# Altium project RasPi-BplusHAT.PrjPcb
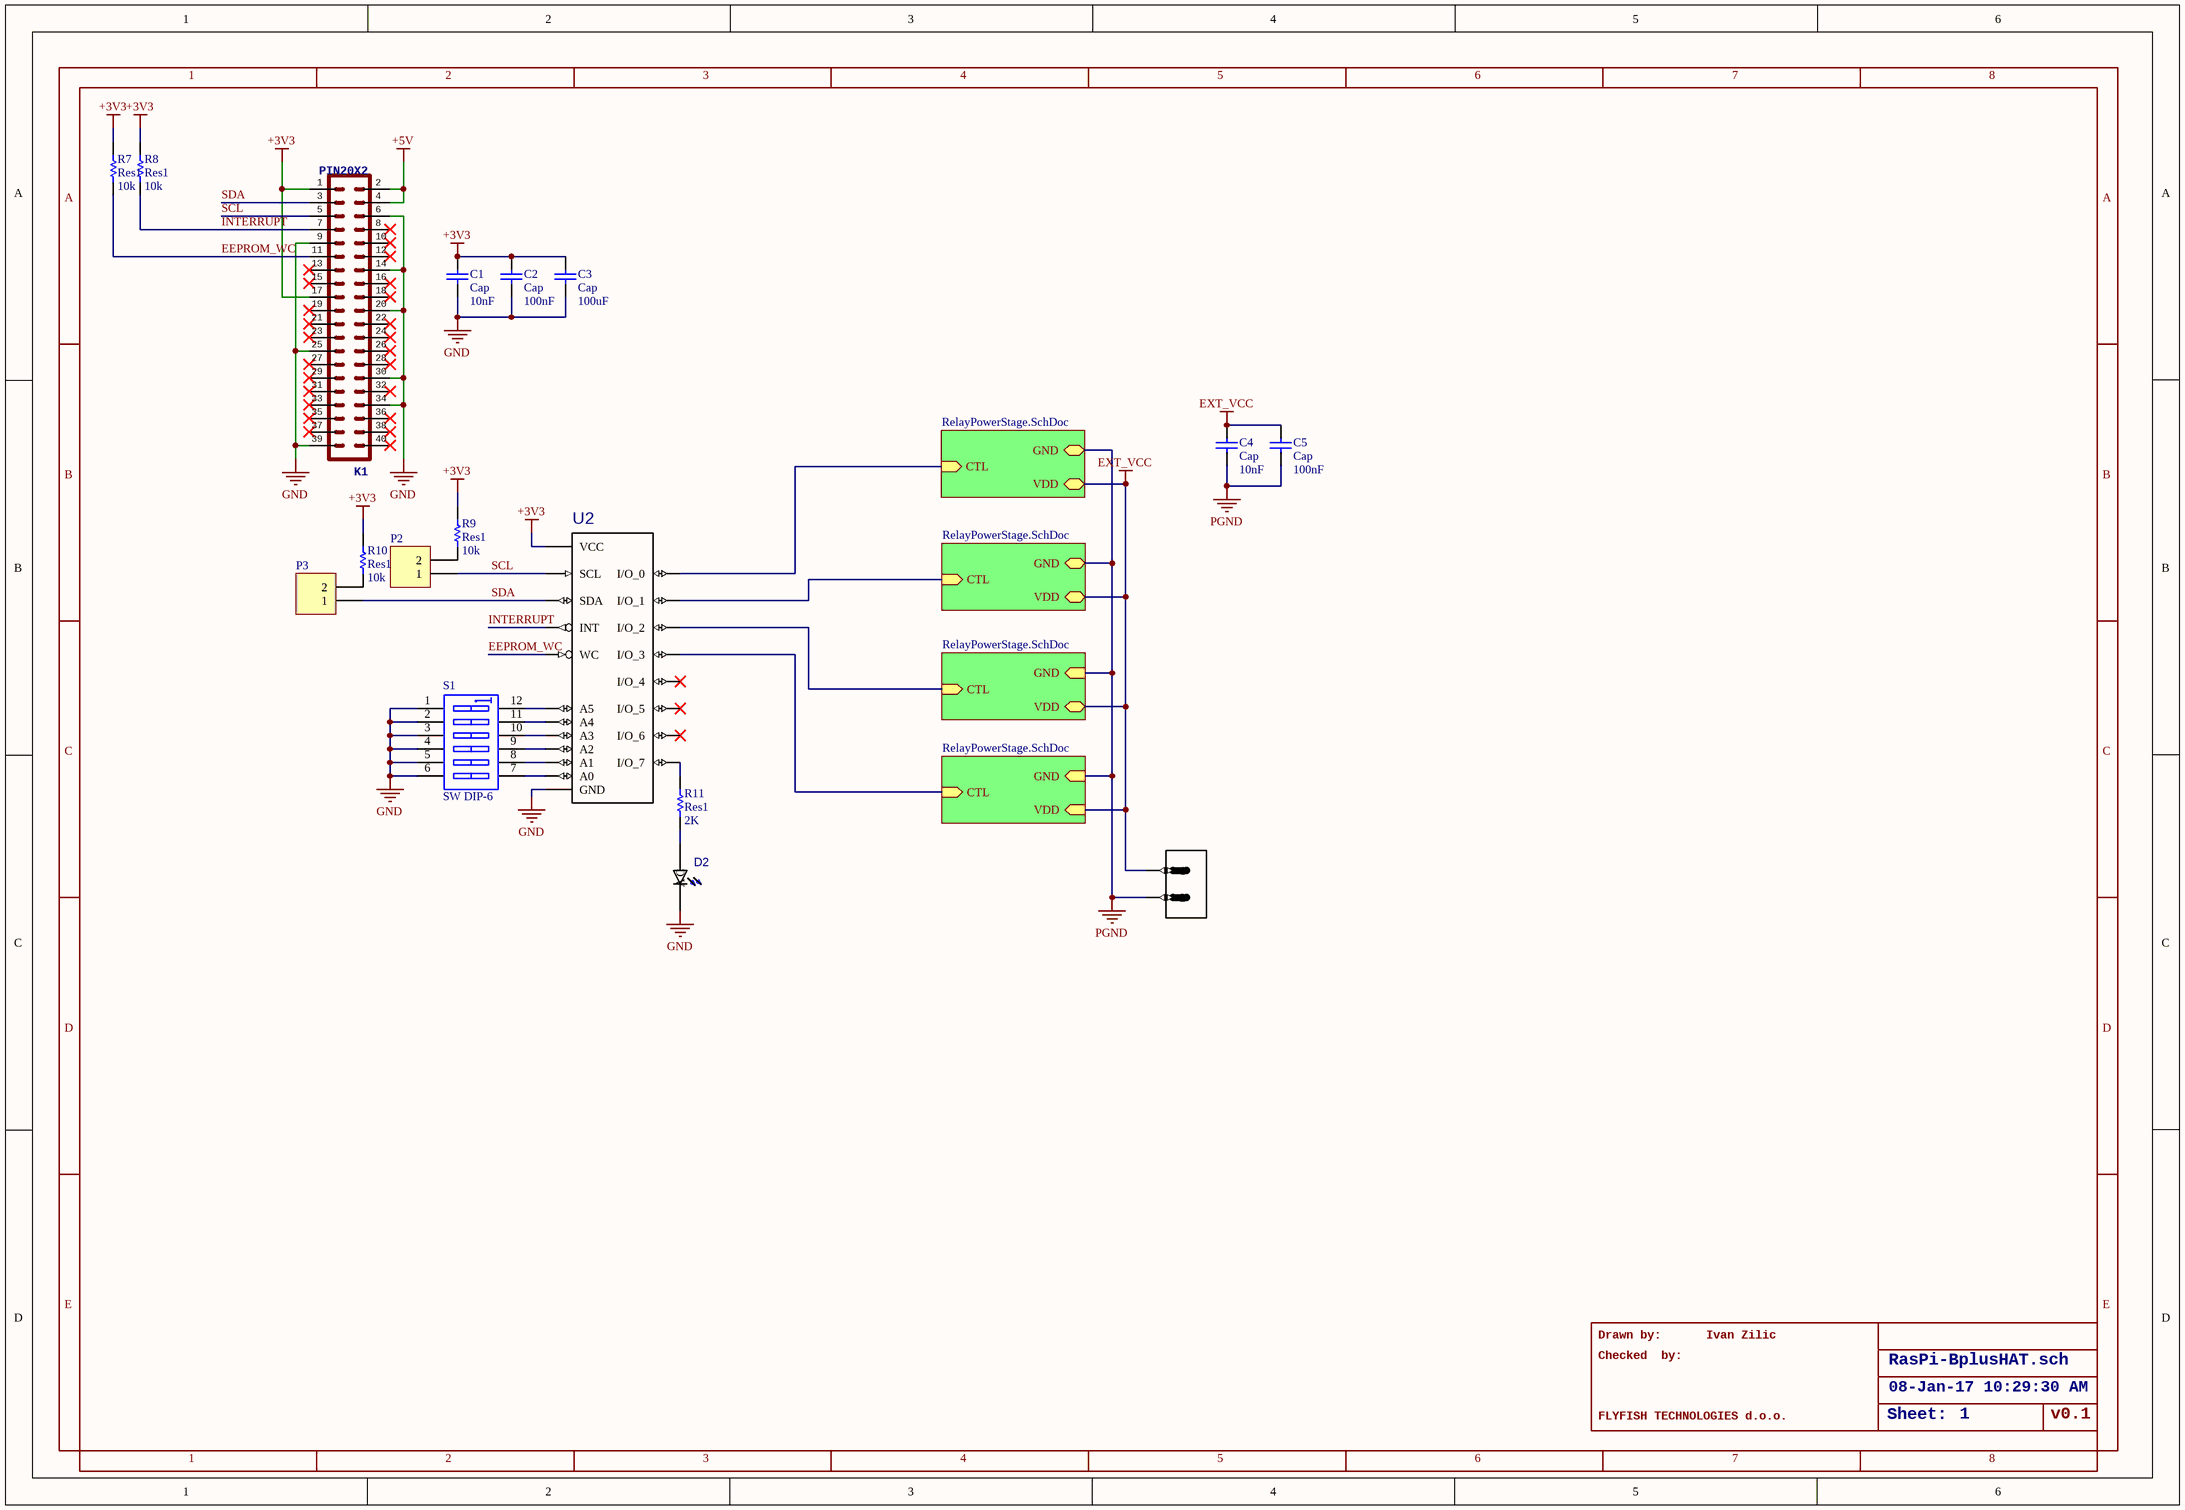
[diagram p0: RasPi-BplusHAT-RELAY.SchDoc]
3 sheets, 79 parts. Net scope: hierarchical (ports join the sheet entries above them; power ports are global).
Board files: RasPi-BplusHAT-MOSFET.PcbDoc, RasPi-BplusHAT-RELAY.PcbDoc
Sheets:
  RasPi-BplusHAT-RELAY.SchDoc
    RM = RelayPowerStage.SchDoc
    RM = RelayPowerStage.SchDoc
    RM = RelayPowerStage.SchDoc
    RM = RelayPowerStage.SchDoc
  MOSFETPowerStage.SchDoc

## Sheet RasPi-BplusHAT-RELAY.SchDoc
size 409 x 282 mm; >DRAWING_NAME: RasPi-BplusHAT.sch; >LAST_DATE_TIME: 08-Jan-17 10:29:30 AM; >SHEET: 1; Sheet:: Sheet:

### Parts
C1  Cap  value 10nF  [6-0805_N]
C2  Cap  value 100nF  [6-0805_N]
C3  Cap  value 100uF  [6-0805_N]
C4  Cap  value 10nF  [6-0805_N]
C5  Cap  value 100nF  [6-0805_N]
D2  0805_LED  [LEDSC200X125X70-2N_598-8160-107F(Primary)]  (value not drawn)
J2  1760510000  [1760490000]  (value not drawn)
K1  >NAME: K1  [HDR2X20]  (hidden comment: PIN20X2)
P2  Header 2  [HDR1X2]  (value not drawn)
P3  Header 2  [HDR1X2]  (value not drawn)
R7  Res1  value 10k  [6-0805_N]
R8  Res1  value 10k  [6-0805_N]
R9  Res1  value 10k  [6-0805_N]
R10  Res1  value 10k  [6-0805_N]
R11  Res1  value 2K  [6-0805_N]
S1  SW DIP-6  [DIP-12/SW]
U2  PCA9501  [TSSOP20]  (value not drawn)

### Sub-sheets
RM = RelayPowerStage.SchDoc: VDD (bidir), GND (bidir), CTL (in)
RM = RelayPowerStage.SchDoc: VDD (bidir), GND (bidir), CTL (in)
RM = RelayPowerStage.SchDoc: VDD (bidir), GND (in), CTL (in)
RM = RelayPowerStage.SchDoc: VDD (in), GND (in), CTL (in)

### Nets
+3V3: C1.2 C2.2 C3.2 K1.1 K1.17 R7.1 R8.1 R9.1 R10.1 U2.20(VCC)
+5V: K1.2 K1.4
EXT_VCC: C4.2 C5.2 J2.1 ; sheet RM/VDD, sheet RM/VDD, sheet RM/VDD, sheet RM/VDD
GND: C1.1 C2.1 C3.1 D2.C K1.6 K1.9 K1.14 K1.20 K1.25 K1.30 K1.34 K1.39 S1.1(A1) S1.2(A2) S1.3(A3) S1.4(A4) S1.5(A5) S1.6(A6) U2.10(GND)
PGND: C4.1 C5.1 J2.2 ; sheet RM/GND, sheet RM/GND, sheet RM/GND, sheet RM/GND
EEPROM_WC: K1.11 R7.2 U2.17(WC)
INTERRUPT: K1.7 R8.2 U2.8(INT)
SCL: K1.5 P2.1 U2.18(SCL)
SDA: K1.3 P3.1 U2.19(SDA)
NetD2_A: D2.A R11.2
NetP2_2: P2.2 R9.2
NetP3_2: P3.2 R10.2
NetR3_RM1_1: U2.7(I/O_3) ; sheet RM/CTL
NetR3_RM2_1: U2.6(I/O_2) ; sheet RM/CTL
NetR3_RM3_1: U2.5(I/O_1) ; sheet RM/CTL
NetR3_RM4_1: U2.4(I/O_0) ; sheet RM/CTL
NetR11_1: R11.1 U2.16(I/O_7)
NetS1_7: S1.7(B6) U2.1(A0)
NetS1_8: S1.8(B5) U2.2(A1)
NetS1_9: S1.9(B4) U2.3(A2)
NetS1_10: S1.10(B3) U2.12(A3)
NetS1_11: S1.11(B2) U2.11(A4)
NetS1_12: S1.12(B1) U2.9(A5)

Not connected (* = marked no-connect by the designer): K1 8* 10* 12* 13* 15* 16* 18* 19* 21* 22* 23* 24* 26* 27* 28* 29* 31* 32* 33* 35* 36* 37* 38* 40*; U2 13(I/O_4)* 14(I/O_5)* 15(I/O_6)*

### Notes on the sheet
- Drawn by:
- Checked  by:
- Ivan Zilic
- FLYFISH TECHNOLOGIES d.o.o.
- v0.1
- 1
- 2
- 3
- 4
- 5
- 6
- 7
- 8
- A
- B
- C
- D
- E

### Library data of the parts
C1-C5 = Cap: Capacitor; Published: 8-Jun-2000; LatestRevisionDate: 17-Jul-2002; LatestRevisionNote: Re-released for DXP Platform.; PackageReference: RAD-0.3; Publisher: Altium Limited; PackageDescription: Radial Cap, Thru-Hole; 2 Leads; 0.3 in Pin Spacing
D2 = 598-8160-107F: LED, SMD; 0805; Yellow-Green; Water Clear Lens; 40mcd; 570/575nm; MF: Dialight; Package: 0805 Dialight; MP: 598-8160-107F; Price: 0.09 USD; Availability: Good; Value: *
J2 = 1760510000: Conn Terminal Block 2 POS 5.08mm Solder ST Thru-Hole 16A; MF: Weidmuller; Package: None; MP: 1760510000; Price: 0.43 USD; Availability: Good; Value: *
P2 P3 = Header 2: Header, 2-Pin; LatestRevisionDate: 17-Jul-2002; LatestRevisionNote: Re-released for DXP Platform.; Publisher: Altium Limited
R7-R11 = Res1: Resistor; Published: 8-Jun-2000; LatestRevisionDate: 17-Jul-2002; LatestRevisionNote: Re-released for DXP Platform.; PackageReference: AXIAL-0.3; Publisher: Altium Limited; PackageDescription: Axial Device, Thru-Hole; 2 Leads; 0.3 in Pin Spacing
S1 = SW DIP-6: DIP Switch, 6 Position, SPST; Published: 24-Mar-1999; LatestRevisionDate: 17-Jul-2002; LatestRevisionNote: Re-released for DXP Platform.; PackageReference: DIP-12/SW; Publisher: Altium Limited; PackageDescription: DIP Switch; 12 Leads
U2 = PCA9501: MF: NXP Semiconductors; MP: PCA9501; Package: None; Availability: Unavailable; Price: None; Value: *
K1 = PIN20X2: >VALUE: PIN20X2

## Sheet RelayPowerStage.SchDoc
size A4
Used 4 times, as channels RM, RM, RM, RM. Parts and nets are listed once, with the designators drawn on the sheet.
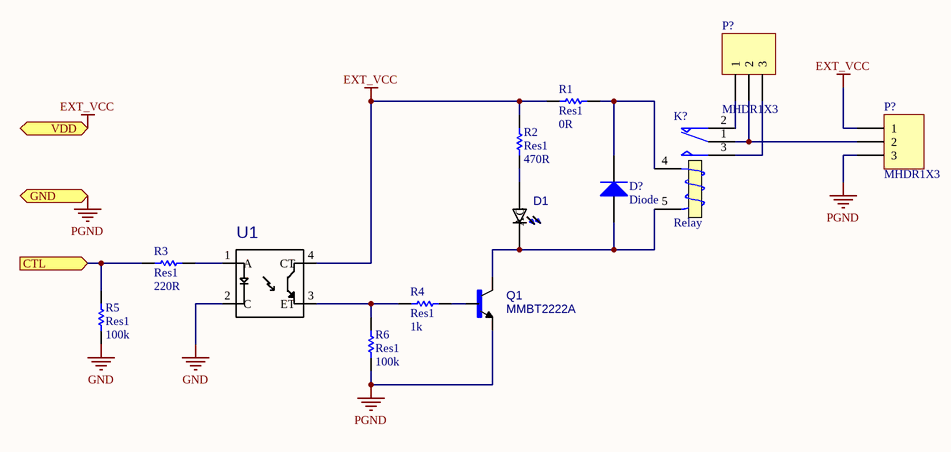
[diagram p1: RelayPowerStage.SchDoc]

### Parts
(Parts that share a designator on the sheet are numbered #1, #2 ... from top to bottom, then left to right.)
D1  0805_LED  [LEDSC200X125X70-2N_598-8160-107F(Primary)]  (value not drawn)
D?  Diode  [S1JL]
K?  Relay  [OUAZ-SH-112L (Mini Relay)]
P?#1  MHDR1X3  [MHDR1X3]
P?#2  MHDR1X3  [MHDR1X3]
Q1  MMBT2222A  [SOT23]
R1  Res1  value 0R  [6-0805_N]
R2  Res1  value 470R  [6-0805_N]
R3  Res1  value 220R  [6-0805_N]
R4  Res1  value 1k  [6-0805_N]
R5  Res1  value 100k  [6-0805_N]
R6  Res1  value 100k  [6-0805_N]
U1  PC817X2NIP0F  [SOT254P975X400-4N]  (value not drawn)

### Ports
CTL (in), GND (in), VDD (in)

### Nets
EXT_VCC: P?#2.1 R1.1 R2.1 U1.4(CT) ; port VDD
GND: R5.2 U1.2(C)
PGND: P?#2.3 Q1.2(E) R6.2 ; port GND
CTL: R3.1 R5.1 ; port CTL
NetD1_A: D1.A R2.2
NetD1_C: D1.C D?.1(A) K?.5(T2) Q1.3(C)
NetD?_2: D?.2(K) K?.4(T1) R1.2
NetK?_1: K?.1(COM) P?#1.2 P?#2.2
NetK?_2: K?.2(NC) P?#1.1
NetK?_3: K?.3(NO) P?#1.3
NetQ1_1: Q1.1(B) R4.2
NetR3_2: R3.2 U1.1(A)
NetR4_1: R4.1 R6.1 U1.3(ET)

### Channels
RM: designators D1=D1_RM#1 D?=D?_RM#1 K?=K?_RM#1 P?=P?_RM#1 P?=P?_RM#2 Q1=Q1_RM#1 R1=R1_RM4 R2=R2_RM4 R3=R3_RM4 R4=R4_RM4 R5=R5_RM4 R6=R6_RM4 U1=U1_RM4; ports CTL=NetR3_RM4_1 GND=PGND VDD=EXT_VCC
RM: designators D1=D1_RM#2 D?=D?_RM#2 K?=K?_RM#2 P?=P?_RM#3 P?=P?_RM#4 Q1=Q1_RM#2 R1=R1_RM3 R2=R2_RM3 R3=R3_RM3 R4=R4_RM3 R5=R5_RM3 R6=R6_RM3 U1=U1_RM3; ports CTL=NetR3_RM3_1 GND=PGND VDD=EXT_VCC
RM: designators D1=D1_RM#3 D?=D?_RM#3 K?=K?_RM#3 P?=P?_RM#5 P?=P?_RM#6 Q1=Q1_RM#3 R1=R1_RM2 R2=R2_RM2 R3=R3_RM2 R4=R4_RM2 R5=R5_RM2 R6=R6_RM2 U1=U1_RM2; ports CTL=NetR3_RM2_1 GND=PGND VDD=EXT_VCC
RM: designators D1=D1_RM#4 D?=D?_RM#4 K?=K?_RM#4 P?=P?_RM#7 P?=P?_RM#8 Q1=Q1_RM#4 R1=R1_RM1 R2=R2_RM1 R3=R3_RM1 R4=R4_RM1 R5=R5_RM1 R6=R6_RM1 U1=U1_RM1; ports CTL=NetR3_RM1_1 GND=PGND VDD=EXT_VCC

### Library data of the parts
D1 = 598-8160-107F: as D2 on sheet RasPi-BplusHAT-RELAY; Package: 0805 Dialight; MP: 598-8160-107F; Price: 0.09 USD; Availability: Good; Value: *
D? = Diode: Default Diode; Published: 8-Jun-2000; LatestRevisionDate: 17-Jul-2002; LatestRevisionNote: Re-released for DXP Platform.; PackageVersion: Sep-1996; PackageReference: SMC; Publisher: Altium Limited; PackageDescription: DO-214-AB/SMC; 2 C-Bend Leads; Body 7.9 x 5.9 mm, inc. leads (LxW); Code_JEDEC: DO-214-AB
K? = Relay: SPDT Relay; Published: 8-Jun-2000; LatestRevisionDate: 17-Jul-2002; LatestRevisionNote: Re-released for DXP Platform.; PackageReference: MODULE5B; Publisher: Altium Limited; Datasheet: http://au.element14.com/te-connectivity/ouaz-sh-112l/relay-signal-spdt-120vac-24vdc/dp/1197687
P?#1 P?#2 = MHDR1X3: Header, 3-Pin; LatestRevisionDate: 17-Jul-2002; LatestRevisionNote: Re-released for DXP Platform.; Publisher: Altium Limited
Q1 = MMBT2222A: MMBT2222 Series 40 V CE Breakdown 1 A NPN General Purpose Amplifier - SOT-23; MF: Fairchild Semiconductor; Package: SOT-23 Fairchild Semiconductor; MP: MMBT2222A; Price: 0.06 USD; Availability: Good; Value: *
R1-R6 = Res1: Resistor; Published: 8-Jun-2000; LatestRevisionDate: 17-Jul-2002; LatestRevisionNote: Re-released for DXP Platform.; PackageReference: AXIAL-0.3; Publisher: Altium Limited; PackageDescription: Axial Device, Thru-Hole; 2 Leads; 0.3 in Pin Spacing
U1 = PC817X2NIP0F: PC817 Series 1 Channel 80 V 5000 Vrms General Purpose Photocoupler - DIP-4; MF: Sharp Microelectronics; Availability: Good; Price: 0.30 USD; Package: PDIP-4 Sharp Microelectronics; MP: PC817X2NIP0F; Value: *

## Sheet MOSFETPowerStage.SchDoc
size A4
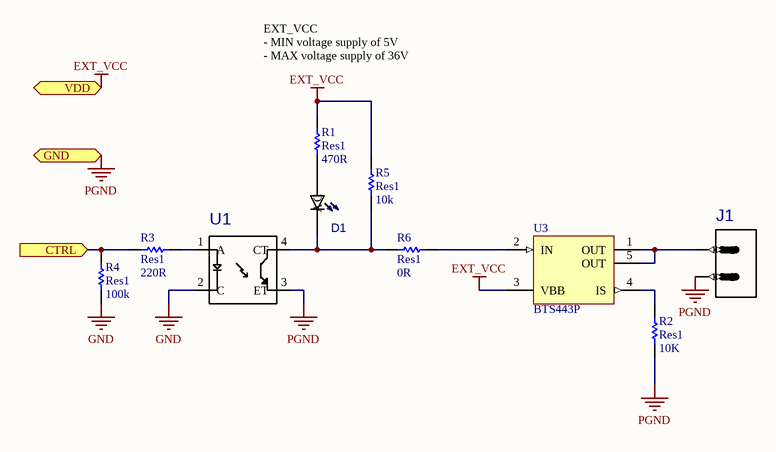
[diagram p2: MOSFETPowerStage.SchDoc]

### Parts
D1  0805_LED  [LEDSC200X125X70-2N_598-8160-107F(Primary)]  (value not drawn)
J1  1760510000  [1760490000]  (value not drawn)
R1  Res1  value 470R  [6-0805_N]
R2  Res1  value 10K  [6-0805_N]
R3  Res1  value 220R  [6-0805_N]
R4  Res1  value 100k  [6-0805_N]
R5  Res1  value 10k  [6-0805_N]
R6  Res1  value 0R  [6-0805_N]
U1  PC817X2NIP0F  [SOT254P975X400-4N]  (value not drawn)
U3  BTS443P  [INF-PG-TO252-5-11_N]

### Ports
CTRL (in), GND, VDD

### Nets
EXT_VCC: R1.1 R5.1 U3.3(VBB) ; port VDD
GND: R4.2 U1.2(C)
PGND: J1.2 R2.2 U1.3(ET) ; port GND
NetD1_A: D1.A R1.2
NetD1_C: D1.C R5.2 R6.1 U1.4(CT)
NetJ1_1: J1.1 U3.1(OUT) U3.5(OUT)
NetR2_1: R2.1 U3.4(IS)
NetR3_1: R3.1 R4.1 ; port CTRL
NetR3_2: R3.2 U1.1(A)
NetR6_2: R6.2 U3.2(IN)

### Notes on the sheet
- EXT_VCC
  - MIN voltage supply of 5V
  - MAX voltage supply of 36V

### Library data of the parts
D1 = 598-8160-107F: as D2 on sheet RasPi-BplusHAT-RELAY; Package: 0805 Dialight; MP: 598-8160-107F; Price: 0.09 USD; Availability: Good; Value: *
J1 = 1760510000: as J2 on sheet RasPi-BplusHAT-RELAY; Package: None; MP: 1760510000; Price: 0.43 USD; Availability: Good; Value: *
R1-R6 = Res1: Resistor; Published: 8-Jun-2000; LatestRevisionDate: 17-Jul-2002; LatestRevisionNote: Re-released for DXP Platform.; PackageReference: AXIAL-0.3; Publisher: Altium Limited; PackageDescription: Axial Device, Thru-Hole; 2 Leads; 0.3 in Pin Spacing
U1 = PC817X2NIP0F: as U1 on sheet RelayPowerStage; Availability: Good; Price: 0.30 USD; Package: PDIP-4 Sharp Microelectronics; MP: PC817X2NIP0F; Value: *
U3 = BTS443P: Smart High-Side Power Switch, 1 Channel, 7.6 A Load Current, -40 to 150 degC, PG-TO252-5-11, Reel, Green; Manufacturer: Infineon; Channels: 1; Green: TRUE; Group: Automotive Qualified; Load Current (typ): 7.6 A; Ptot (max): 42 W; Recommended Operating Voltage Max.: 36 V; Recommended Operating Voltage Min.: 5 V; RON @ 25degreesC: 16 mOhm; RON(max) @ 150degreesC: 31 mOhm; toff (max): 410 us; DatasheetVersion: Rev. 1.0; PackageVersion: Nov-10; PackageReference: PG-TO252-5-11; PackageDescription: 5-Pin Plastic (Green) Transistor Single Outline Package, 6.5 x 6.12 mm Body, 1.14 mm Pitch; Supplier 1: Mouser; Supplier Part Number 1: 726-BTS443P; Supplier 2: Newark; Supplier Part Number 2: 58M4071; Supplier 3: Farnell; Supplier Part Number 3: 1440808; Supplier 4: Farnell; Supplier Part Number 4: 1440808RL; Supplier 5: Digi-Key; Supplier Part Number 5: BTS443PINTR-ND; Supplier 6: Digi-Key; Supplier Part Number 6: BTS443PINCT-ND; Supplier 7: Digi-Key; Supplier Part Number 7: BTS443PINDKR-ND; Halogen-free: TRUE; Packing: Reel; ton (max): 410 us; Mounting Technology: Surface Mount; PartNumber: BTS443P; ComponentLink1Description: Manufacturer URL; ComponentLink1URL: http://www.infineon.com/; ComponentLink2Description: Datasheet; ComponentLink2URL: http://www.infineon.com/dgdl/BTS443P_DS_v10.pdf?folderId=db3a304314dca389011537739e37155f&fileId=db3a3043183a9555011860442f5b3616&location=en.Products.Automotive_ICs.Smart_High-_and_Low-Side_Switches.PROFET__-_Smart_High_Side_Switches.DATASHEET.BTS443P_DS_v10.pdf; ComponentLink3Description: Package Specification; ComponentLink3URL: http://www.infineon.com/dgdl/TLE7276-Data+Sheet-+v1_11.pdf?folderId=db3a304412b407950112b408e8c90004&fileId=db3a304412b407950112b436c53f66c8&sId=db3a30433db6f09f013dc0e43c0428c1

## Nets that join several sheets
EXT_VCC: RasPi-BplusHAT-RELAY (C4.2 C5.2 J2.1), RM (P?_RM#2.1 R1_RM4.1 R2_RM4.1 U1_RM4.4), RM (P?_RM#4.1 R1_RM3.1 R2_RM3.1 U1_RM3.4), RM (P?_RM#6.1 R1_RM2.1 R2_RM2.1 U1_RM2.4), RM (P?_RM#8.1 R1_RM1.1 R2_RM1.1 U1_RM1.4), MOSFETPowerStage (R1.1 R5.1 U3.3)
GND: RasPi-BplusHAT-RELAY (19 pins), RM (R5_RM4.2 U1_RM4.2), RM (R5_RM3.2 U1_RM3.2), RM (R5_RM2.2 U1_RM2.2), RM (R5_RM1.2 U1_RM1.2), MOSFETPowerStage (R4.2 U1.2)
PGND: RasPi-BplusHAT-RELAY (C4.1 C5.1 J2.2), RM (P?_RM#2.3 Q1_RM#1.2 R6_RM4.2), RM (P?_RM#4.3 Q1_RM#2.2 R6_RM3.2), RM (P?_RM#6.3 Q1_RM#3.2 R6_RM2.2), RM (P?_RM#8.3 Q1_RM#4.2 R6_RM1.2), MOSFETPowerStage (J1.2 R2.2 U1.3)
NetR3_RM1_1: RasPi-BplusHAT-RELAY (U2.7), RM (R3_RM1.1 R5_RM1.1)
NetR3_RM2_1: RasPi-BplusHAT-RELAY (U2.6), RM (R3_RM2.1 R5_RM2.1)
NetR3_RM3_1: RasPi-BplusHAT-RELAY (U2.5), RM (R3_RM3.1 R5_RM3.1)
NetR3_RM4_1: RasPi-BplusHAT-RELAY (U2.4), RM (R3_RM4.1 R5_RM4.1)